# EAGLE design controller-adapter (EAGLE 6.6.0)
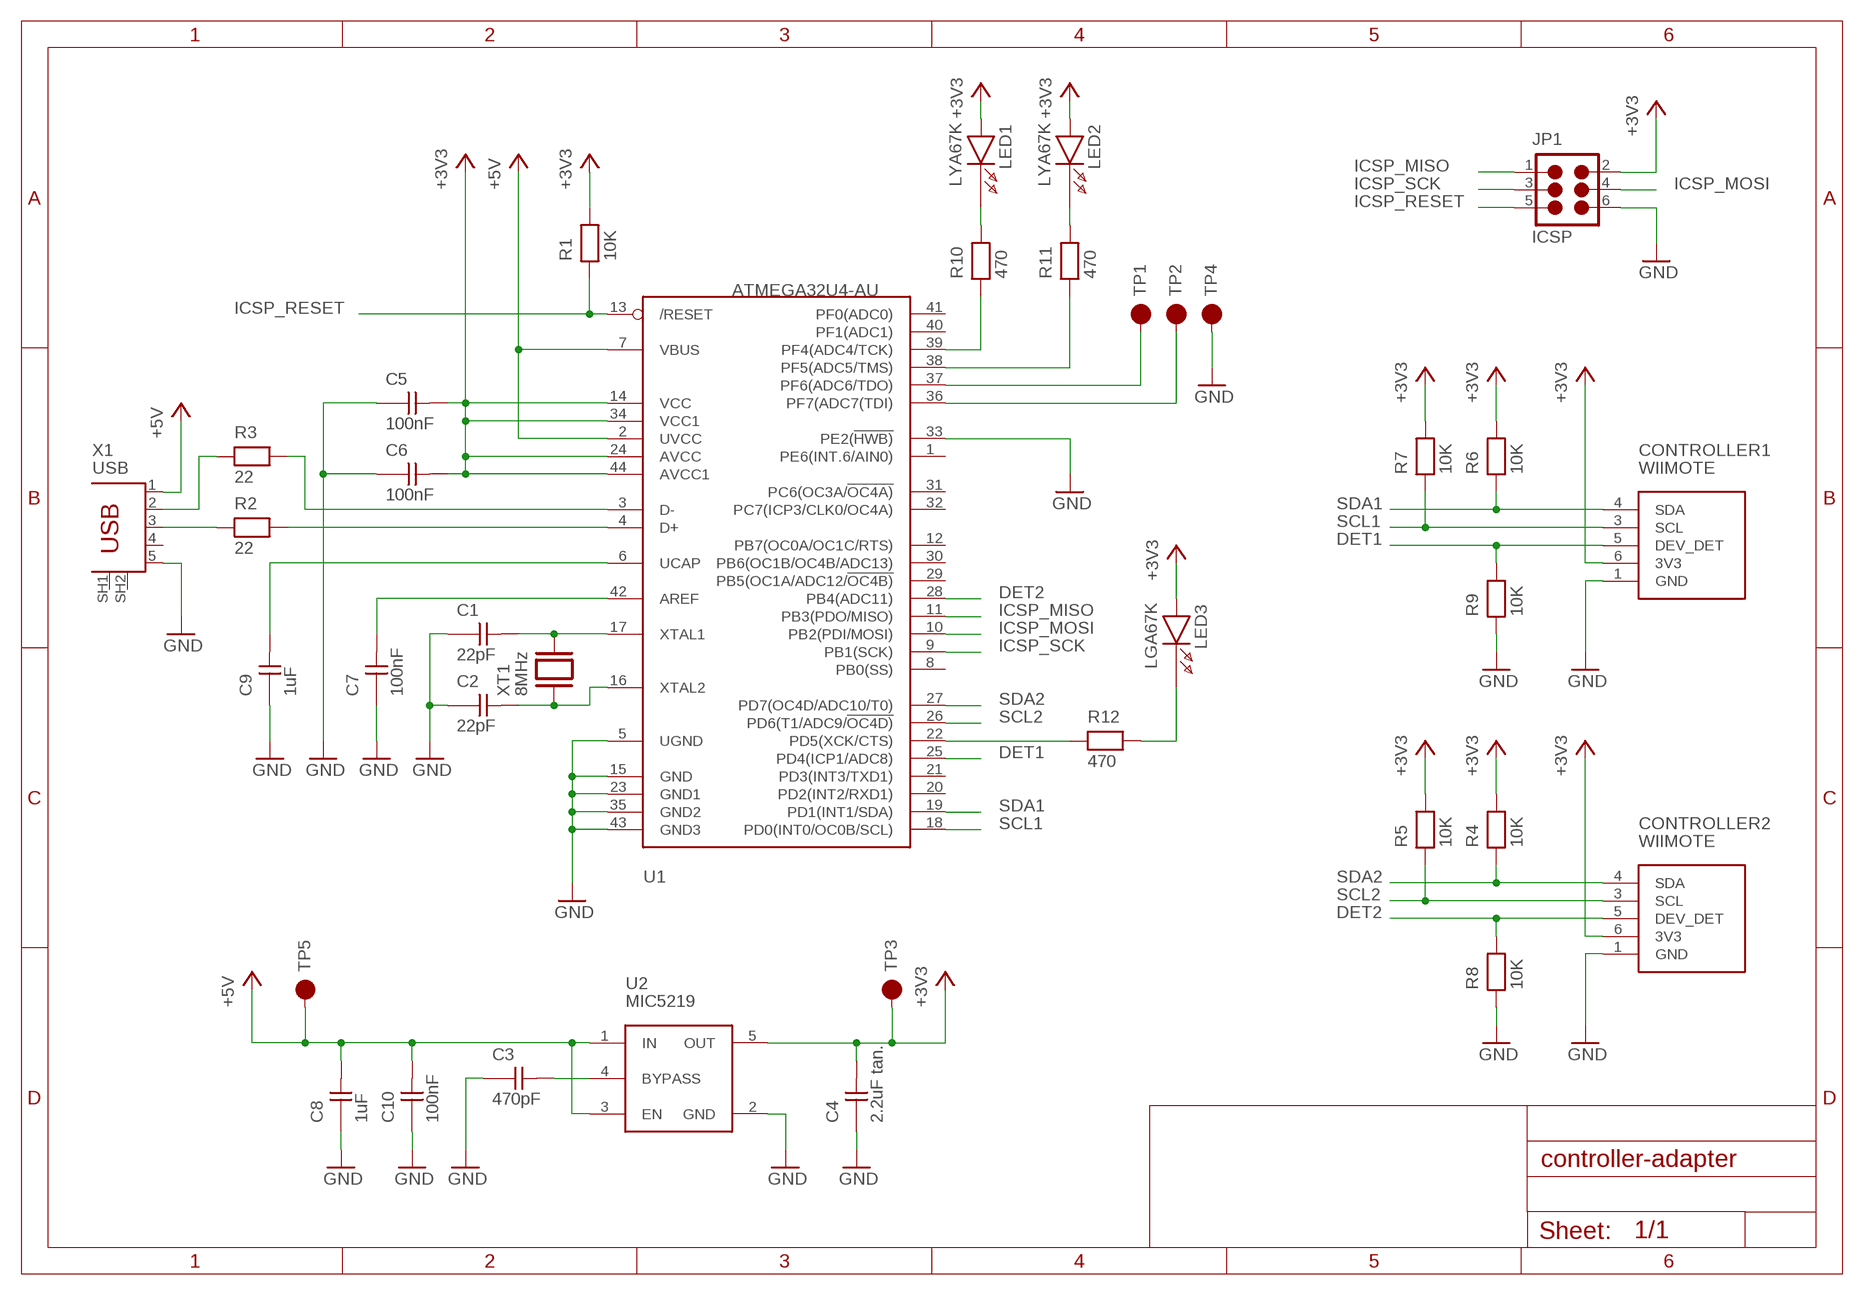
[diagram p0: schematic, sheet 1]

## Parts
C1  22pF  C0603  [0603]
C2  22pF  C0603  [0603]
C3  470pF  C0603  [0603]
C4  2.2uF tan.  C1206  [1206]
C5  100nF  C0603  [0603]
C6  100nF  C0603  [0603]
C7  100nF  C0603  [0603]
C8  1uF  C0603  [0603]
C9  1uF  C0603  [0603]
C10  100nF  C0603  [0603]
CONTROLLER1  WIIMOTE  [WIIMOTE]
CONTROLLER2  WIIMOTE  [WIIMOTE]
JP1  ICSP  JP6  [JP6]
LED1  LYA67K  LEDSIDE  [SIDELED]
LED2  LYA67K  LEDSIDE  [SIDELED]
LED3  LGA67K  LEDSIDE  [SIDELED]
R1  10K  R0603  [0603]
R2  22  R0603  [0603]
R3  22  R0603  [0603]
R4  10K  R0603  [0603]
R5  10K  R0603  [0603]
R6  10K  R0603  [0603]
R7  10K  R0603  [0603]
R8  10K  R0603  [0603]
R9  10K  R0603  [0603]
R10  470  R0603  [0603]
R11  470  R0603  [0603]
R12  470  R0603  [0603]
TP1  A1  TP1,6MM  [TP1MM6]
TP2  A0  TP1,6MM  [TP1MM6]
TP3  +3V3  TP1,6MM  [TP1MM6]
TP4  GND  TP1,6MM  [TP1MM6]
TP5  +5V  TP1,6MM  [TP1MM6]
U1  ATMEGA32U4-AU  [TQFP44]
U2  MIC5219  [SOT23-5]
X1  USB  USB_MICRO_B_MOLEX  [USB_MICRO_B_PIN]
XT1  8MHz  XTABM3B  [ABM3B]

## Nets
+3V3: C4.2 C5.2 C6.2 CONTROLLER1.6(3V3) CONTROLLER2.6(3V3) JP1.2 LED1.A LED2.A LED3.A R1.2 R4.2 R5.2 R6.2 R7.2 TP3.1 U1.14(VCC) U1.24(AVCC) U1.34(VCC1) U1.44(AVCC1) U2.5(OUT)
+5V: C8.2 C10.2 TP5.1 U1.2(UVCC) U1.7(VBUS) U2.1(IN) U2.3(EN) X1.1(VBUS)
DET1: CONTROLLER1.5(DEV_DET) R9.2 U1.25(PD4(ICP1/ADC8))
DET2: CONTROLLER2.5(DEV_DET) R8.2 U1.28(PB4(ADC11))
GND: C1.1 C2.1 C3.1 C4.1 C5.1 C6.1 C7.1 C8.1 C9.1 C10.1 CONTROLLER1.1(GND) CONTROLLER2.1(GND) JP1.6 R8.1 R9.1 TP4.1 U1.5(UGND) U1.15(GND) U1.23(GND1) U1.33(PE2(!HWB)) U1.35(GND2) U1.43(GND3) U2.2(GND) X1.5(GND)
ICSP_MISO: JP1.1 U1.11(PB3(PDO/MISO))
ICSP_MOSI: JP1.4 U1.10(PB2(PDI/MOSI))
ICSP_RESET: JP1.5 R1.1 U1.13(/RESET)
ICSP_SCK: JP1.3 U1.9(PB1(SCK))
N$1: C1.2 U1.17(XTAL1) XT1.3
N$2: C2.2 U1.16(XTAL2) XT1.1
N$3: TP1.1 U1.37(PF6(ADC6/TDO))
N$4: C3.2 U2.4(BYPASS)
N$5: R2.2 U1.4(D+)
N$6: R2.1 X1.3(D+)
N$7: R3.2 U1.3(D-)
N$8: R3.1 X1.2(D-)
N$9: TP2.1 U1.36(PF7(ADC7(TDI))
N$10: C7.2 U1.42(AREF)
N$11: C9.2 U1.6(UCAP)
N$12: R11.1 U1.38(PF5(ADC5/TMS))
N$13: R10.1 U1.39(PF4(ADC4/TCK))
N$14: LED1.K R10.2
N$15: LED2.K R11.2
N$16: R12.1 U1.22(PD5(XCK/CTS))
N$17: LED3.K R12.2
SCL1: CONTROLLER1.3(SCL) R7.1 U1.18(PD0(INT0/OC0B/SCL))
SCL2: CONTROLLER2.3(SCL) R5.1 U1.26(PD6(T1/ADC9/!OC4D))
SDA1: CONTROLLER1.4(SDA) R6.1 U1.19(PD1(INT1/SDA))
SDA2: CONTROLLER2.4(SDA) R4.1 U1.27(PD7(OC4D/ADC10/T0))
Unconnected: U1.1(PE6(INT.6/AIN0)) U1.8(PB0(SS)) U1.12(PB7(OC0A/OC1C/RTS)) U1.20(PD2(INT2/RXD1)) U1.21(PD3(INT3/TXD1)) U1.29(PB5(OC1A/ADC12/!OC4B)) U1.30(PB6(OC1B/OC4B/ADC13)) U1.31(PC6(OC3A/!OC4A)) U1.32(PC7(ICP3/CLK0/OC4A)) U1.40(PF1(ADC1)) U1.41(PF0(ADC0)) X1.4(ID) X1.SH1(TAB) X1.SH2(TAB)

## Library data of the parts
C1-C10 = controller-adapter:C
CONTROLLER1 CONTROLLER2 = controller-adapter:WIIMOTE
JP1 = controller-adapter:JP6
LED1-LED3 = controller-adapter:LED: Osram Lx A67K
R1-R12 = controller-adapter:R
TP1-TP5 = controller-adapter:TP
U1 = controller-adapter:ATMEGA32U4
U2 = controller-adapter:MIC5219
X1 = controller-adapter:USB_MICRO_B_MOLEX: Micro USB B Receptacle
XT1 = controller-adapter:XT

## Board
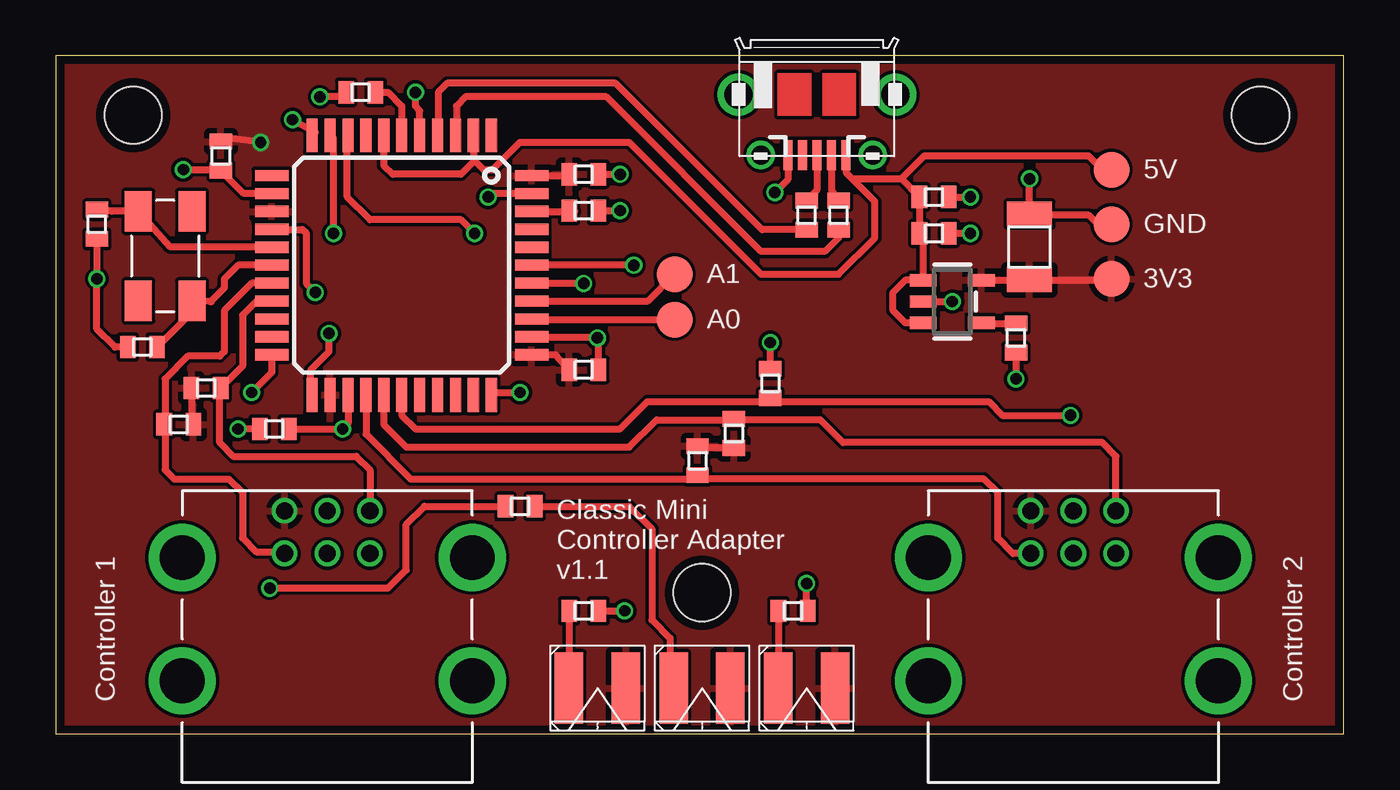
[diagram p1: board, top side]
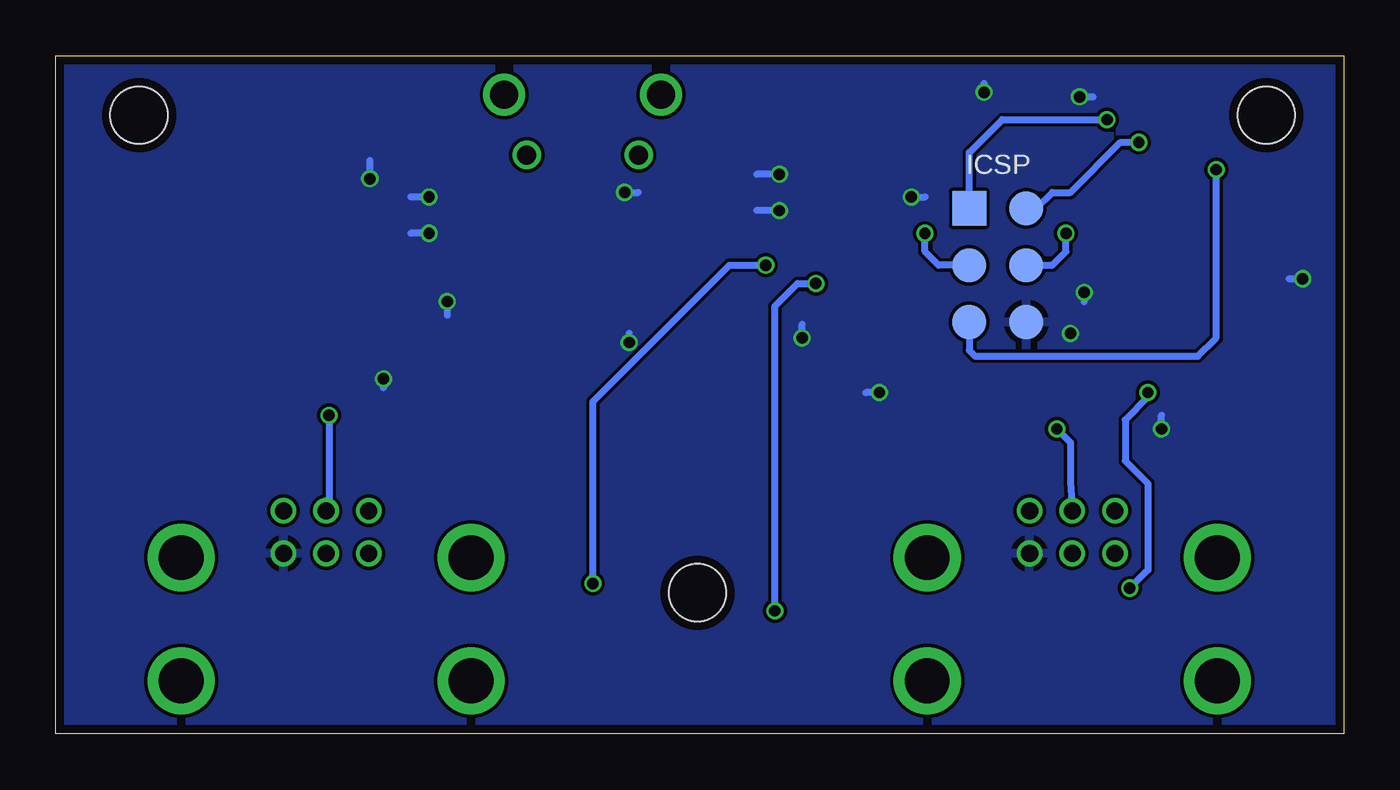
[diagram p2: board, bottom side, seen from below]

Size 57.51 x 30.28 mm. Coordinates in mm from the lower left corner, seen from the top.
Outline: 0,0 57.51,0 57.51,30.28 0,30.28 0,0
Copper layers (1*16): Top 0.035559375mm / dielectric 1.6mm / Bottom 0.035559375mm
Design rules "oshpark-2layer": minimum track width 6mil, minimum drill 10mil, track to track 6mil, track to pad 6mil, pad to pad 6mil, via to via 6mil, smd to smd 6mil, copper to edge 15mil, drill to drill 6mil, minimum pad ring 5mil, minimum via ring 5mil, stop-mask expansion 2.5mil, vias tented up to drill 0mil, thermal gap 10mil
Holes 2.54 mm at 3.45,27.64 28.85,6.3 53.8,27.64

### Footprints (pad centres in the part's own frame; a part is rotated, then mirrored left to right if it is on the bottom)
0603 = smd 0.7 x 1: 1 -0.65,0; 2 0.65,0
1206 = smd 1.092 x 2.007: 1 -1.473,0; 2 1.473,0
WIIMOTE = drill 0.762: 1 0,1.905; 2 1.905,1.905; 3 3.81,1.905; 4 0,0; 5 1.905,0; 6 3.81,0 | drill 2: SH1 -4.572,7.589; SH2 8.382,7.589; SH3 -4.572,2.089; SH4 8.382,2.089
JP6 = smd 1.524 x 1.524: 1 -2.54,-1.27; 2 -2.54,1.27; 3 0,-1.27; 4 0,1.27; 5 2.54,-1.27; 6 2.54,1.27
SIDELED = smd 1.27 x 3.2: A 1.27,0; K -1.27,0
TP1MM6 = smd 1.6 x 1.6: 1 0,0
TQFP44 = smd 1.5 x 0.5: 1 -5.8,4; 2 -5.8,3.2; 3 -5.8,2.4; 4 -5.8,1.6; 5 -5.8,0.8; 6 -5.8,0; 7 -5.8,-0.8; 8 -5.8,-1.6; 9 -5.8,-2.4; 10 -5.8,-3.2; 11 -5.8,-4; 23 5.8,-4; 24 5.8,-3.2; 25 5.8,-2.4; 26 5.8,-1.6; 27 5.8,-0.8; 28 5.8,0; 29 5.8,0.8; 30 5.8,1.6; 31 5.8,2.4; 32 5.8,3.2; 33 5.8,4 | smd 0.5 x 1.5: 12 -4,-5.8; 13 -3.2,-5.8; 14 -2.4,-5.8; 15 -1.6,-5.8; 16 -0.8,-5.8; 17 0,-5.8; 18 0.8,-5.8; 19 1.6,-5.8; 20 2.4,-5.8; 21 3.2,-5.8; 22 4,-5.8; 34 4,5.8; 35 3.2,5.8; 36 2.4,5.8; 37 1.6,5.8; 38 0.8,5.8; 39 0,5.8; 40 -0.8,5.8; 41 -1.6,5.8; 42 -2.4,5.8; 43 -3.2,5.8; 44 -4,5.8
SOT23-5 = smd 0.55 x 1.2: 1 -0.95,-1.3; 2 0,-1.3; 3 0.95,-1.3; 4 0.95,1.3; 5 -0.95,1.3
USB_MICRO_B_PIN = smd 1.35 x 0.4: 1 2.7,1.3; 2 2.7,0.65; 3 2.7,0; 4 2.7,-0.65; 5 2.7,-1.3 | drill 0.85 pad 1.25: SH1 2.7,2.5; SH2 2.7,-2.5 | drill 1.25 pad 1.8: SH3 0,3.5; SH4 0,-3.5
ABM3B = smd 1.8 x 1.2: 1 -2,-1.2; 2 2,-1.2; 3 2,1.2; 4 -2,1.2

### Placement (x,y rotation side)
C1  3.86,17.27 0 top
C2  1.83,22.76 90 top
C3  42.88,17.68 90 top
C4  43.48,21.74 270 top
C5  23.57,24.99 180 top
C6  23.57,16.26 180 top
C7  23.57,23.37 180 top
C8  39.22,23.98 180 top
C9  13.61,28.65 0 top
C10  39.22,22.35 180 top
CONTROLLER1  14.02,9.96 180 top
CONTROLLER2  47.35,9.96 180 top
JP1  15.44,20.93 270 bottom
LED1  33.53,2.03 0 top
LED2  24.18,2.03 0 top
LED3  28.85,2.03 0 top
R1  7.37,25.81 90 top
R2  33.53,23.16 270 top
R3  34.95,23.16 270 top
R4  30.28,13.41 270 top
R5  28.65,12.19 90 top
R6  6.71,15.44 180 top
R7  5.49,13.82 0 top
R8  31.9,15.65 270 top
R9  9.75,13.61 0 top
R10  32.92,5.49 180 top
R11  23.57,5.49 180 top
R12  20.73,10.16 0 top
TP1  27.64,20.52 0 top
TP2  27.64,18.49 0 top
TP3  47.14,20.32 0 top
TP4  47.14,22.76 0 top
TP5  47.14,25.2 0 top
U1  15.44,20.93 270 top
U2  40.03,19.3 270 top
X1  33.99,28.55 270 top
XT1  4.88,21.34 270 top

### Tracks (layer width: path | path; a pad name or v marks a point on that pad's centre or on a via)
+3V3  (via drill 0.51)
  Top 0.305: U2.5 41.33,20.27 C4.2 47.09,20.27 TP3.1 | v9.14,26.42 7.53,26.62 R1.2 | U1.34 22.3,16.93 C6.2 | U1.44 23.06,24.93 C5.2 | 6.11,13.89 R7.2 6.06,13.9 R6.2 | R4.2 28.73,12.76 R5.2
  Bottom 0.305: JP1.2 13.72,23.47 13.01,24.18 12.19,24.18 9.96,26.42 v9.14,26.42
  pour Top: -0.41,30.68 57.91,30.68 57.91,-0.41 -0.41,-0.41
+5V
  Top 0.305: 38.61,20.38 U2.1 | U2.1 38.73,22.35 C10.2 C8.2 37.76,24.79 | U2.1 37.93,20.25 37.39,19.71 37.39,18.9 37.93,18.35 U2.3 | X1.1 35.28,25.07 35.56,24.79 | 35.56,24.79 37.76,24.79 | TP5.1 46.74,25.2 46.13,25.81 38.77,25.81 37.76,24.79 | U1.7 14.64,25.39 15.04,24.99 18.09,24.99 18.64,25.55 U1.2 18.64,25.65 19.1,25.2 19.51,25.2 20.73,26.42 25.6,26.42 31.5,20.52 34.95,20.52 36.58,22.15 36.58,23.77 35.56,24.79
DET1  (via drill 0.51)
  Top 0.305: U1.25 13.04,13.86 v12.8,13.61 R9.2
  Bottom 0.305: v12.8,13.61 12.19,13.01 12.19,11.25 CONTROLLER1.5
DET2  (via drill 0.51)
  Top 0.305: U1.28 15.44,14.22 16.05,13.61 25.2,13.61 26.42,14.83 31.9,14.83 | 31.9,14.83 41.66,14.83 42.27,14.22 v45.31,14.22 | R8.2 31.9,14.83
  Bottom 0.305: v45.31,14.22 45.31,9.88 CONTROLLER2.5
GND  (via drill 0.51)
  Top 0.305: C1.1 2.64,17.27 1.83,18.09 v1.83,20.32 C2.1 | v43.48,24.79 C4.1 43.54,23.16 46.13,23.16 46.53,22.76 TP4.1 | C3.1 v42.88,15.85 | U2.2 v40.03,19.3 | U1.23 11.38,15.44 11.38,16.26 12.19,17.07 v12.19,17.88 | U1.33 19.51,15.24 v20.73,15.24 | U1.35 24.13,17.73 v24.18,17.68 24.22,17.64 C6.1 | U1.15 11,22.53 11.18,22.35 11.18,20.12 v11.58,19.71 | C5.1 v25.2,24.99 | C7.1 v25.2,23.37 | C9.1 12.8,28.45 v11.79,28.45 | X1.5 32.69,24.76 v32.11,24.18 | U1.43 19.46,24.13 v19.3,23.98 | U1.5 16.24,27.83 16.05,28.04 v16.05,28.65 | C8.1 v40.84,23.98 | C10.1 v40.84,22.35 | R8.1 v31.9,17.48 | R9.1 v8.13,13.61
  Bottom 0.305: v1.83,20.32 2.44,20.32 | v43.48,24.79 43.48,25.6 | v42.88,15.85 42.88,15.44 | v40.03,19.3 40.03,18.69 | v12.19,17.88 12.19,18.09 | v20.73,15.24 21.34,15.24 | v24.18,17.68 24.18,18.29 | v11.58,19.71 11.58,19.3 | v25.2,24.99 26.21,24.99 | v25.2,23.37 26.21,23.37 | v11.79,28.45 11.18,28.45 | v32.11,24.18 31.5,24.18 | v19.3,23.98 18.69,23.98 | v16.05,28.65 16.05,29.06 | v40.84,23.98 41.66,23.98 | v40.84,22.35 41.66,22.35 | v31.9,17.48 31.9,17.88 | v8.13,13.61 8.13,14.22
  pour Bottom: -0.81,31.09 58.32,31.09 58.32,-0.81 -0.81,-0.81
ICSP_MISO  (via drill 0.51)
  Top 0.305: v10.57,27.43 11.58,26.87 U1.11
  Bottom 0.305: JP1.1 16.71,25.96 15.24,27.43 v10.57,27.43
ICSP_MOSI  (via drill 0.51)
  Top 0.305: v12.39,22.35 12.39,26.62 U1.10
  Bottom 0.305: JP1.4 13.01,20.93 12.39,21.54 v12.39,22.35
ICSP_RESET  (via drill 0.51)
  Top 0.305: U1.13 8.39,24.13 R1.1 7.33,25.2 v5.69,25.2
  Bottom 0.305: JP1.5 16.71,17.12 16.46,16.87 6.5,16.87 5.69,17.68 v5.69,25.2
ICSP_SCK  (via drill 0.51)
  Top 0.305: v18.69,22.35 18.09,22.96 14.02,22.96 13.01,23.98 13.01,26.69 U1.9
  Bottom 0.305: JP1.3 18.09,20.93 18.69,21.54 v18.69,22.35
N$1
  Top 0.305: U1.17 8.13,20.93 7.52,20.32 7.52,19.91 6.91,19.3 6.94,19.3 XT1.3 6.08,18.84 C1.2
N$2
  Top 0.305: U1.16 9.36,21.73 9.14,21.74 5.11,21.74 XT1.1 2.51,23.34 C2.2
N$3
  Top 0.305: U1.37 26.44,19.33 TP1.1
N$4
  Top 0.305: U2.4 41.33,18.33 C3.2
N$5
  Top 0.305: R2.2 31.54,22.52 24.99,29.06 17.48,29.06 17.07,28.65 17.07,26.75 U1.4
N$6
  Top 0.305: X1.3 33.98,24.27 R2.1
N$7
  Top 0.305: R3.2 34.95,22.15 34.34,21.54 31.5,21.54 24.59,28.45 18.29,28.45 17.88,28.04 17.88,26.77 U1.3
N$8
  Top 0.305: X1.2 34.63,24.28 R3.1
N$9
  Top 0.305: U1.36 21.37,18.53 21.34,18.49 TP2.1
N$10
  Top 0.305: U1.42 23.16,23.33 C7.2
N$11
  Top 0.305: C9.2 14.83,28.65 15.44,28.04 15.44,26.82 15.48,26.77 U1.6
N$12  (via drill 0.51)
  Top 0.305: R11.1 v25.4,5.49 | v23.57,20.12 21.26,20.12 U1.38
  Bottom 0.305: v25.4,5.49 25.4,19.1 24.38,20.12 v23.57,20.12
N$13  (via drill 0.51)
  Top 0.305: R10.1 33.53,5.49 v33.53,6.71 | v25.81,20.93 U1.39
  Bottom 0.305: v33.53,6.71 33.53,14.83 27.43,20.93 v25.81,20.93
N$14
  Top 0.305: R10.2 32.26,5.49 LED1.K
N$15
  Top 0.305: R11.2 LED2.K
N$16  (via drill 0.51)
  Top 0.305: U1.22 9.64,16.15 v8.74,15.24 | v9.55,6.5 14.83,6.5 15.65,7.32 15.65,9.35 16.46,10.16 R12.1
  Bottom 0.305: v8.74,15.24 8.74,15.04 9.75,14.02 9.75,12.19 8.74,11.18 8.74,7.32 v9.55,6.5
N$17
  Top 0.305: R12.2 25.6,10.16 26.62,9.14 26.62,5.08 27.43,4.27 27.43,1.98 LED3.K
SCL1
  Top 0.305: U1.18 8.75,20.13 7.52,18.9 7.52,17.07 7.32,16.87 5.89,16.87 4.88,15.85 4.88,13.76 R7.1 4.88,13.82 4.88,11.79 5.28,11.38 7.72,11.38 8.33,10.77 8.33,8.74 8.94,8.13 10.13,8.13 CONTROLLER1.3
SCL2
  Top 0.305: CONTROLLER2.3 42.75,8.05 42.06,8.74 42.06,10.77 41.45,11.38 28.81,11.38 R5.1 28.49,11.38 15.85,11.38 13.84,13.39 U1.26
SDA1
  Top 0.305: U1.19 8.97,19.33 8.33,18.69 8.33,16.42 R6.1 7.32,15.4 7.32,13.01 7.92,12.39 13.41,12.39 14.02,11.79 CONTROLLER1.4
SDA2
  Top 0.305: CONTROLLER2.4 47.35,12.39 46.74,13.01 35.15,13.01 34.14,14.02 30.32,14.02 R4.1 30.24,14.02 26.82,14.02 25.6,12.8 15.65,12.8 14.64,13.8 U1.27

### Text on the board
tNames: 5V | GND | A1 | 3V3 | A0 | Classic Mini / Controller Adapter / v1.1 | Controller 1 | Controller 2
bNames: ICSP